# EAGLE schematic LiPoLoader_td (EAGLE 5.09)
BEST: Farnell 1611967; TYP: EEUFM1V102
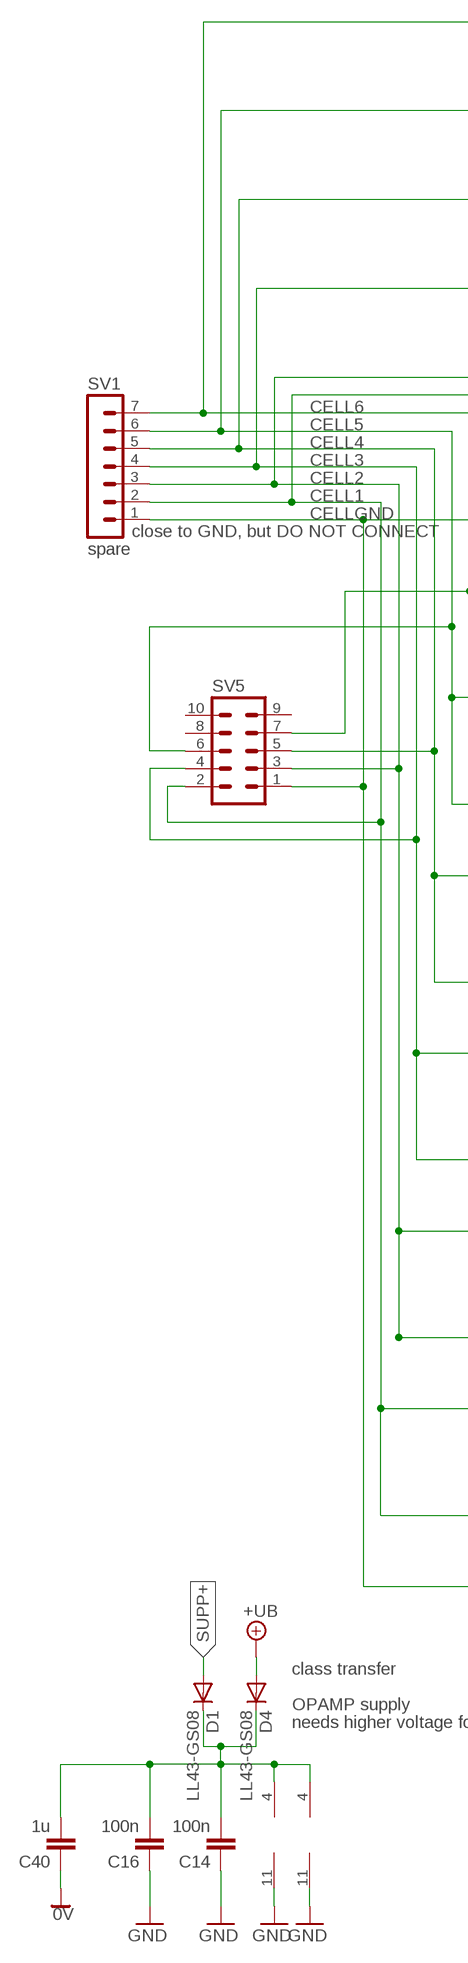
[diagram p0: schematic, sheet 1, part 1 of 2]
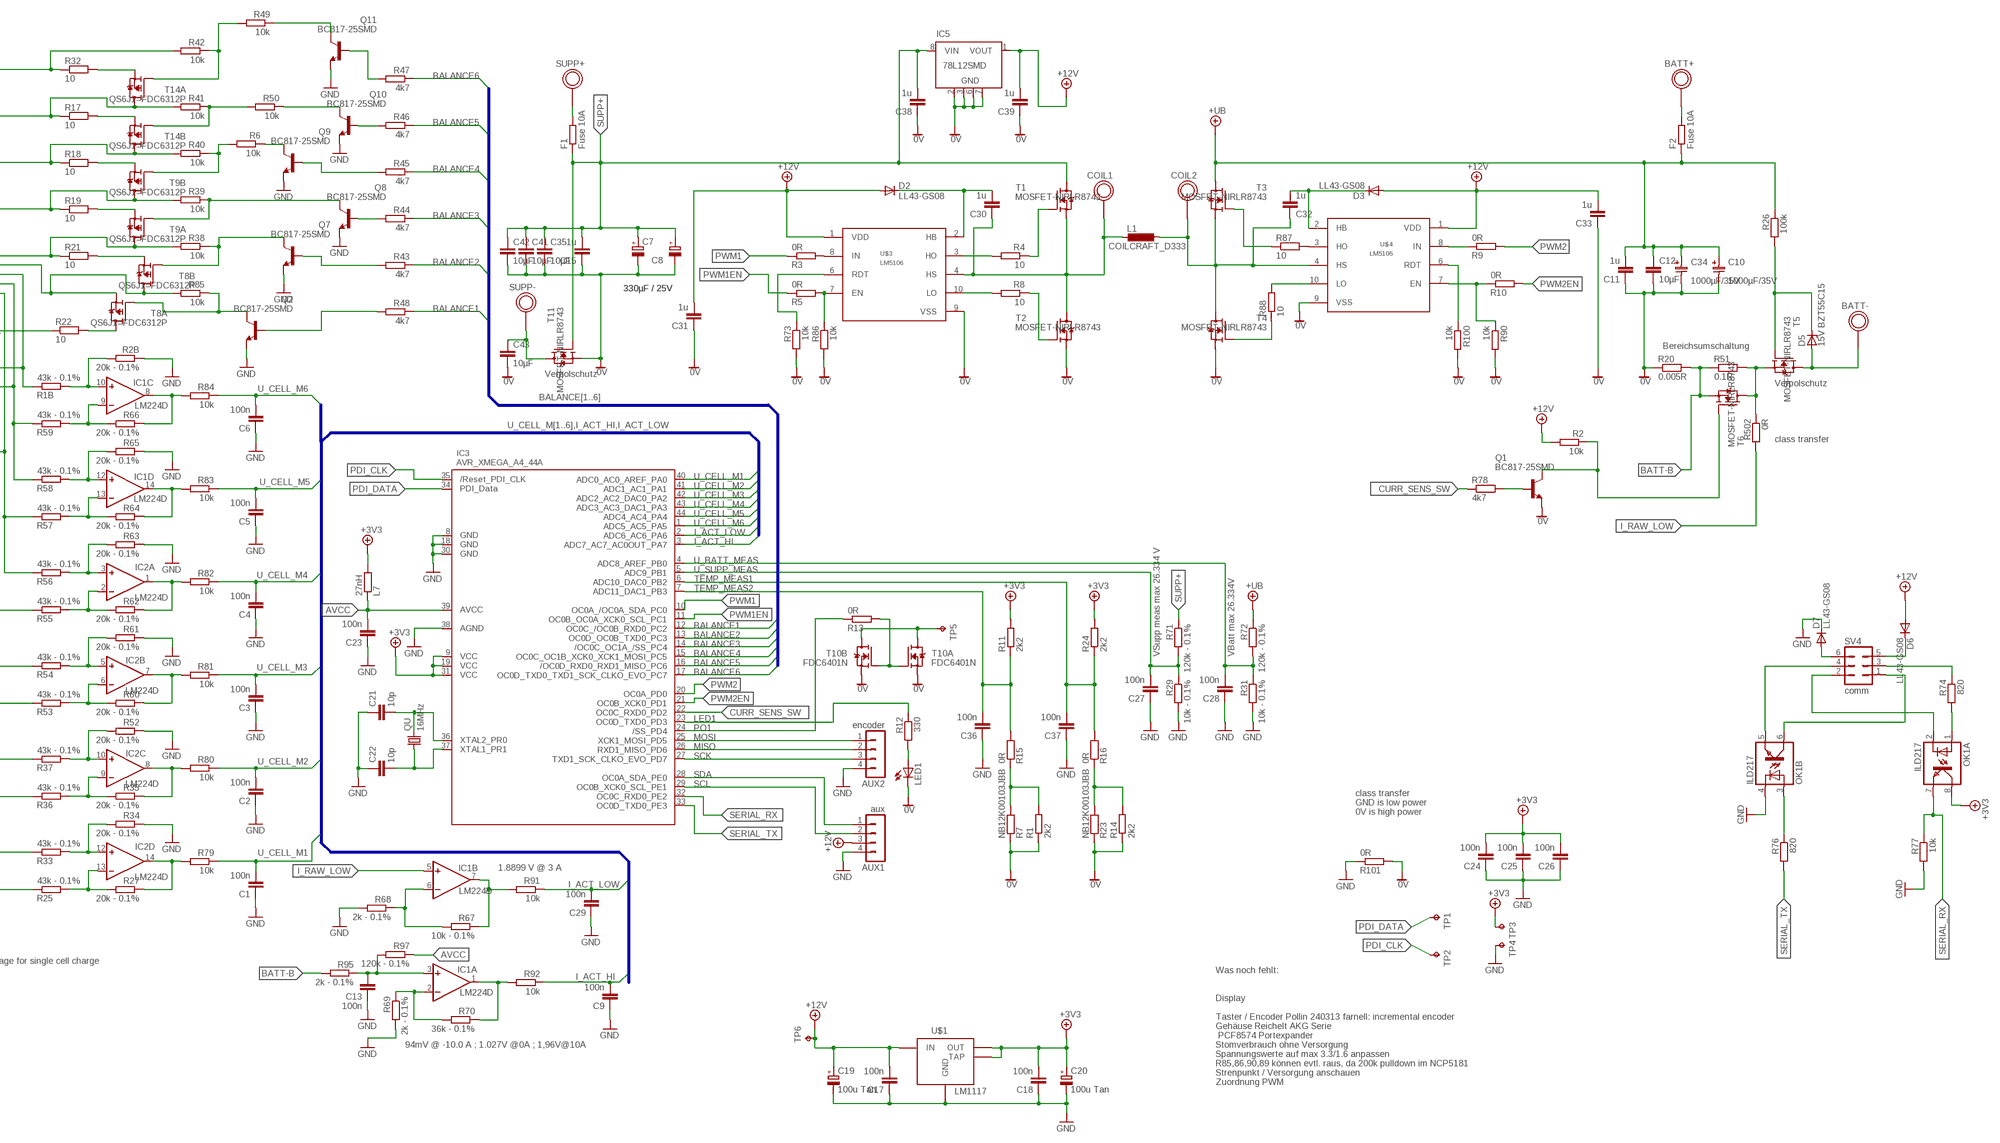
[diagram p1: schematic, sheet 1, part 2 of 2]

## Parts
AUX1  aux  MA04-1  [MA04-1]
AUX2  encoder  MA04-1  [MA04-1]
BATT+  SOLPAD3MM  [SOLPAD3MM]
BATT-  SOLPAD3MM  [SOLPAD3MM]
C1  100n  C-EUC0603K  [C0603K]
C2  100n  C-EUC0603K  [C0603K]
C3  100n  C-EUC0603K  [C0603K]
C4  100n  C-EUC0603K  [C0603K]
C5  100n  C-EUC0603K  [C0603K]
C6  100n  C-EUC0603K  [C0603K]
C7  330µF / 25V  CPOL-EUE3.5-8  [E3,5-8]
C8  330µF / 25V  CPOL-EUE3.5-8  [E3,5-8]
C9  100n  C-EUC0603K  [C0603K]
C10  1000µF/35V  CPOL  [E5-13-L]
C11  1u  C-EUC1206K  [C1206K]
C12  10µF  C-EUC1206K  [C1206K]
C13  100n  C-EUC0603K  [C0603K]
C14  100n  C-EUC0603K  [C0603K]
C15  1u  C-EUC1206K  [C1206K]
C16  100n  C-EUC0603K  [C0603K]
C17  100n  C-EUC0603K  [C0603K]
C18  100n  C-EUC0603K  [C0603K]
C19  100u Tan  CPOL-EUSMCC  [SMC_C]
C20  100u Tan  CPOL-EUSMCC  [SMC_C]
C21  10p  C-EUC0603  [C0603]
C22  10p  C-EUC0603  [C0603]
C23  100n  C-EUC0603K  [C0603K]
C24  100n  C-EUC0603K  [C0603K]
C25  100n  C-EUC0603K  [C0603K]
C26  100n  C-EUC0603K  [C0603K]
C27  100n  C-EUC0603K  [C0603K]
C28  100n  C-EUC0603K  [C0603K]
C29  100n  C-EUC0603K  [C0603K]
C30  1u  C-EUC1206K  [C1206K]
C31  1u  C-EUC1206K  [C1206K]
C32  1u  C-EUC1206K  [C1206K]
C33  1u  C-EUC1206K  [C1206K]
C34  1000µF/35V  CPOL  [E5-13-L]
C35  10µF  C-EUC1206K  [C1206K]
C36  100n  C-EUC0603K  [C0603K]
C37  100n  C-EUC0603K  [C0603K]
C38  1u  C-EUC1206K  [C1206K]
C39  1u  C-EUC1206K  [C1206K]
C40  1u  C-EUC1206K  [C1206K]
C41  10µF  C-EUC1206K  [C1206K]
C42  10µF  C-EUC1206K  [C1206K]
C43  10µF  C-EUC1206K  [C1206K]
COIL1  SOLPAD3MM  [SOLPAD3MM]
COIL2  SOLPAD3MM  [SOLPAD3MM]
D1  LL43-GS08  DIODE-SOD80C  [SOD80C]
D2  LL43-GS08  DIODE-SOD80C  [SOD80C]
D3  LL43-GS08  DIODE-SOD80C  [SOD80C]
D4  LL43-GS08  DIODE-SOD80C  [SOD80C]
D5  15V BZT55C15  ZENER-DIODESOD80C  [SOD80C]
D6  LL43-GS08  DIODE-SOD80C  [SOD80C]
D7  LL43-GS08  DIODE-SOD80C  [SOD80C]
F1  Fuse 10A  R-EU_WSC2515  [WSC2515]
F2  Fuse 10A  R-EU_WSC2515  [WSC2515]
IC1  LM224D  LM324D  [SO14]
IC2  LM224D  LM324D  [SO14]
IC3  AVR_XMEGA_A4_44A  [TQFP44]
IC5  78L12SMD  78L05SMD  [SO08]
L1  COILCRAFT_D333  [D333]
L7  27nH  R-EU_R0603  [R0603]
LED1  LED5MM  [LED5MM]
OK1  ILD217  [SOIC08]
Q1  BC817-25SMD  [SOT23-BEC]
Q2  BC817-25SMD  [SOT23-BEC]
Q7  BC817-25SMD  [SOT23-BEC]
Q8  BC817-25SMD  [SOT23-BEC]
Q9  BC817-25SMD  [SOT23-BEC]
Q10  BC817-25SMD  [SOT23-BEC]
Q11  BC817-25SMD  [SOT23-BEC]
QU  16MHz  CRYSTALHC49U-V  [HC49U-V]
R1  2k2  R-EU_R0603  [R0603]
R1B  43k - 0.1%  R-EU_R0603  [R0603]
R2  10k  R-EU_R0603  [R0603]
R2B  20k - 0.1%  R-EU_R0603  [R0603]
R3  0R  R-EU_R0603  [R0603]
R4  10  R-EU_R0603  [R0603]
R5  0R  R-EU_R0603  [R0603]
R6  10k  R-EU_R0603  [R0603]
R7  NB12K00103JBB  R-EU_R0603  [R0603]
R8  10  R-EU_R0603  [R0603]
R9  0R  R-EU_R0603  [R0603]
R10  0R  R-EU_R0603  [R0603]
R11  2k2  R-EU_R0603  [R0603]
R12  330  R-EU_R0805  [R0805]
R13  0R  R-EU_R0603  [R0603]
R14  2k2  R-EU_R0603  [R0603]
R15  0R  R-EU_R0603  [R0603]
R16  0R  R-EU_R0603  [R0603]
R17  10  R-EU_R2512  [R2512]
R18  10  R-EU_R2512  [R2512]
R19  10  R-EU_R2512  [R2512]
R20  0.005R  R-EU_R2010  [R2010]
R21  10  R-EU_R2512  [R2512]
R22  10  R-EU_R2512  [R2512]
R23  NB12K00103JBB  R-EU_R0603  [R0603]
R24  2k2  R-EU_R0603  [R0603]
R25  43k - 0.1%  R-EU_R0603  [R0603]
R26  100k  R-EU_R0603  [R0603]
R27  20k - 0.1%  R-EU_R0603  [R0603]
R29  10k - 0.1%  R-EU_R0603  [R0603]
R31  10k - 0.1%  R-EU_R0603  [R0603]
R32  10  R-EU_R2512  [R2512]
R33  43k - 0.1%  R-EU_R0603  [R0603]
R34  20k - 0.1%  R-EU_R0603  [R0603]
R35  20k - 0.1%  R-EU_R0603  [R0603]
R36  43k - 0.1%  R-EU_R0603  [R0603]
R37  43k - 0.1%  R-EU_R0603  [R0603]
R38  10k  R-EU_R0603  [R0603]
R39  10k  R-EU_R0603  [R0603]
R40  10k  R-EU_R0603  [R0603]
R41  10k  R-EU_R0603  [R0603]
R42  10k  R-EU_R0603  [R0603]
R43  4k7  R-EU_R0603  [R0603]
R44  4k7  R-EU_R0603  [R0603]
R45  4k7  R-EU_R0603  [R0603]
R46  4k7  R-EU_R0603  [R0603]
R47  4k7  R-EU_R0603  [R0603]
R48  4k7  R-EU_R0603  [R0603]
R49  10k  R-EU_R0603  [R0603]
R50  10k  R-EU_R0603  [R0603]
R51  0.1R  R-EU_R2010  [R2010]
R52  20k - 0.1%  R-EU_R0603  [R0603]
R53  43k - 0.1%  R-EU_R0603  [R0603]
R54  43k - 0.1%  R-EU_R0603  [R0603]
R55  43k - 0.1%  R-EU_R0603  [R0603]
R56  43k - 0.1%  R-EU_R0603  [R0603]
R57  43k - 0.1%  R-EU_R0603  [R0603]
R58  43k - 0.1%  R-EU_R0603  [R0603]
R59  43k - 0.1%  R-EU_R0603  [R0603]
R60  20k - 0.1%  R-EU_R0603  [R0603]
R61  20k - 0.1%  R-EU_R0603  [R0603]
R62  20k - 0.1%  R-EU_R0603  [R0603]
R63  20k - 0.1%  R-EU_R0603  [R0603]
R64  20k - 0.1%  R-EU_R0603  [R0603]
R65  20k - 0.1%  R-EU_R0603  [R0603]
R66  20k - 0.1%  R-EU_R0603  [R0603]
R67  10k - 0.1%  R-EU_R0603  [R0603]
R68  2k - 0.1%  R-EU_R0603  [R0603]
R69  2k - 0.1%  R-EU_R0603  [R0603]
R70  36k - 0.1%  R-EU_R0603  [R0603]
R71  120k - 0.1%  R-EU_R0603  [R0603]
R72  120k - 0.1%  R-EU_R0603  [R0603]
R73  10k  R-EU_R0603  [R0603]
R74  820  R-EU_R0603  [R0603]
R76  820  R-EU_R0603  [R0603]
R77  10k  R-EU_R0603  [R0603]
R78  4k7  R-EU_R0603  [R0603]
R79  10k  R-EU_R0603  [R0603]
R80  10k  R-EU_R0603  [R0603]
R81  10k  R-EU_R0603  [R0603]
R82  10k  R-EU_R0603  [R0603]
R83  10k  R-EU_R0603  [R0603]
R84  10k  R-EU_R0603  [R0603]
R85  10k  R-EU_R0603  [R0603]
R86  10k  R-EU_R0603  [R0603]
R87  10  R-EU_R0603  [R0603]
R88  10  R-EU_R0603  [R0603]
R90  10k  R-EU_R0603  [R0603]
R91  10k  R-EU_R0603  [R0603]
R92  10k  R-EU_R0603  [R0603]
R95  2k - 0.1%  R-EU_R0603  [R0603]
R97  120k - 0.1%  R-EU_R0603  [R0603]
R100  10k  R-EU_R0603  [R0603]
R101  0R  R-EU_R0603  [R0603]
R502  0R  R-EU_R0603  [R0603]
SUPP+  SOLPAD3MM  [SOLPAD3MM]
SUPP-  SOLPAD3MM  [SOLPAD3MM]
SV1  spare  MA07-1  [MA07-1]
SV4  comm  ML6L  [ML6L]
SV5  CON_BOX_10L  [ML10L]
T1  MOSFET-NIRLR8743  [DPAK]
T2  MOSFET-NIRLR8743  [DPAK]
T3  MOSFET-NIRLR8743  [DPAK]
T4  MOSFET-NIRLR8743  [DPAK]
T5  MOSFET-NIRLR8743  [DPAK]
T6  MOSFET-NIRLR8743  [DPAK]
T8  QS6J1=FDC6312P  [SUPERSOT-6]
T9  QS6J1=FDC6312P  [SUPERSOT-6]
T10  FDC6401N  [SUPERSOT-6]
T11  MOSFET-NIRLR8743  [DPAK]
T14  QS6J1=FDC6312P  [SUPERSOT-6]
TP1  TPTP15R  [TP15R]
TP2  TPTP15R  [TP15R]
TP3  TPTP15R  [TP15R]
TP4  TPTP15R  [TP15R]
TP5  TPTP15R  [TP15R]
TP6  TPTP15R  [TP15R]
U$1  LM1117  [SOT223]
U$3  LM5106  [MSOP10W]
U$4  LM5106  [MSOP10W]

## Nets
0V [Hi-Power]: C7.- C8.- C10.- C11.1 C12.2 C15.1 C31.1 C33.1 C34.- C35.2 C38.1 C39.1 C40.1 C41.2 C42.2 C43.2 IC5.2(GND) IC5.3(GND) IC5.6(GND) IC5.7(GND) LED1.K(C) Q1.E R1.1 R7.1 R14.1 R20.1 R23.1 R73.2 R86.2 R90.2 R100.2 R101.2 T2.3(S) T4.3(S) T10.P$2(B:S) T10.P$5(A:S) T11.3(S) U$3.9(VSS) U$4.9(VSS)
+3V3 [Lo-Power]: C18.2 C20.+ C24.2 C25.2 C26.2 IC3.9(VCC1) IC3.19(VCC2) IC3.31(VCC3) L7.2 OK1.8(A:COL) R11.2 R24.2 TP3.TP U$1.MID(OUT) U$1.TAP
+12V [Lo-Power]: AUX1.3 C17.2 C19.+ C31.2 C33.2 C39.2 D2.A D3.A D6.A IC5.1(VOUT) R2.2 TP6.TP U$1.RIGHT(IN) U$3.1(VDD) U$4.1(VDD)
+UB [Hi-Power]: C10.+ C11.2 C12.1 C34.+ D4.A F2.1 R26.1 R72.1 T3.4(D)
AVCC: C23.2 IC3.39(AVCC) L7.1 R97.1
BALANCE1: IC3.12(PC2) R48.1
BALANCE2: IC3.13(PC3) R43.1
BALANCE3: IC3.14(PC4) R44.1
BALANCE4: IC3.15(PC5) R45.1
BALANCE5: IC3.16(PC6) R46.1
BALANCE6: IC3.17(PC7) R47.1
BATT- [Hi-Power]: BATT-.P$1 D5.A T5.4(D)
BATT-A [Hi-Power]: R51.2 R502.1 T5.3(S) T6.4(D)
BATT-B [Hi-Power]: R20.2 R51.1 R95.2 T6.3(S)
BUS_GND [Iso-bus]: OK1.2(A:C) SV4.2
BUS_RX [Iso-bus]: R74.1 SV4.3
BUS_SUPP [Iso-bus]: OK1.6(B:COL) SV4.1
BUS_TX [Iso-bus]: OK1.5(B:EMIT) SV4.4
CELL1 [Lo-Power]: R33.1 R36.1 R85.2 SV1.2 SV5.2 T8.P$4(B:D) T8.P$5(A:S)
CELL2 [Lo-Power]: R21.1 R37.1 R38.2 R53.1 SV1.3 SV5.3 T9.P$6(A:D)
CELL3 [Lo-Power]: R19.1 R39.2 R54.1 R55.1 SV1.4 SV5.4 T9.P$4(B:D)
CELL4 [Lo-Power]: R18.1 R40.2 R56.1 R57.1 SV1.5 SV5.5 T14.P$4(B:D)
CELL5 [Lo-Power]: R17.1 R41.2 R58.1 R59.1 SV1.6 SV5.6 T14.P$6(A:D)
CELL6 [Lo-Power]: R1B.1 R32.1 R42.2 SV1.7 SV5.7
CELLGND [Lo-Power]: R22.1 R25.1 SV1.1 SV5.1
CURR_SENS_SW: IC3.22(PD2) R78.1
GND [Lo-Power]: AUX1.4 AUX2.4 C1.1 C2.1 C3.1 C4.1 C5.1 C6.1 C9.1 C13.1 C14.1 C16.1 C17.1 C18.1 C19.- C20.- C21.1 C22.1 C23.1 C24.1 C25.1 C26.1 C27.1 C28.1 C29.1 C36.1 C37.1 D7.C IC1.11(P:V-) IC2.11(P:V-) IC3.8(GND1) IC3.18(GND2) IC3.30(GND3) IC3.38(AGND) OK1.4(B:C) Q2.E Q7.E Q8.E Q9.E Q10.E Q11.E R2B.1 R29.2 R31.2 R34.1 R52.1 R61.1 R63.1 R65.1 R68.2 R69.2 R77.2 R101.1 TP4.TP U$1.LEFT(GND)
I_ACT_HI: C9.2 IC3.3(PA7) R92.1
I_ACT_LOW: C29.2 IC3.2(PA6) R91.1
I_RAW_HI_R: C13.2 IC1.3(A:+IN) R95.1 R97.2
I_RAW_LOW: IC1.5(B:+IN) R502.2
LED1: IC3.23(PD3) R12.1
MISO: AUX2.2 IC3.26(PD6)
MOSI: AUX2.1 IC3.25(PD5)
N$1: IC1.10(C:+IN) R1B.2 R2B.2
N$2: IC1.12(D:+IN) R58.2 R65.2
N$3: IC1.9(C:-IN) R59.2 R66.2
N$4 [Lo-Power]: R8.1 T2.1(G)
N$5 [Lo-Power]: R87.2 U$4.3(HO)
N$6 [Lo-Power]: R22.2 T8.P$6(A:D)
N$7: IC1.13(D:-IN) R57.2 R64.2
N$8: IC1.6(B:-IN) R67.2 R68.1
N$9: R100.1 U$4.6(RDT)
N$10: OK1.3(B:A) R76.1
N$11: IC2.3(A:+IN) R56.2 R63.2
N$12: IC2.2(A:-IN) R55.2 R62.2
N$13 [Lo-Power]: R88.1 T4.1(G)
N$14 [Hi-Power]: BATT+.P$1 F2.2
N$15 [Lo-Power]: R4.2 U$3.3(HO)
N$16: IC2.5(B:+IN) R54.2 R61.2
N$17: IC2.6(B:-IN) R53.2 R60.2
N$18: IC2.12(D:+IN) R33.2 R34.2
N$19 [Lo-Power]: D7.A SV4.6
N$20: LED1.A R12.2
N$21: IC2.10(C:+IN) R37.2 R52.2
N$22: IC2.9(C:-IN) R35.2 R36.2
N$23: IC2.13(D:-IN) R25.2 R27.2
N$24 [Iso-bus]: OK1.1(A:A) R74.2
N$25 [Hi-Power]: C32.1 COIL2.P$1 L1.2 T3.3(S) T4.4(D) U$4.4(HS)
N$28: IC1.2(A:-IN) R69.1 R70.2
N$30: IC1.8(C:OUT) R66.1 R84.2
N$31: C21.2 IC3.36(PR0) QU.2
N$32: C22.2 IC3.37(PR1) QU.1
N$33 [Lo-Power]: T10.P$4(B:D) T10.P$6(A:D) TP5.TP
N$35: Q1.B R78.2
N$36: IC1.7(B:OUT) R67.1 R91.2
N$37 [Hi-Power]: C30.1 COIL1.P$1 L1.1 T1.3(S) T2.4(D) U$3.4(HS)
N$39 [Hi-Power]: F1.2 SUPP+.P$1
N$40: D5.C R26.2 T5.1(G)
N$41: Q8.C R39.1 T9.P$1(A:G)
N$42: Q9.C R6.1
N$43: R5.2 R86.1 U$3.7(EN)
N$44: R9.1 U$4.8(IN)
N$46: R13.2 T10.P$1(A:G) T10.P$3(B:G)
N$48 [Lo-Power]: R21.2 T8.P$2(B:S)
N$49 [Lo-Power]: R19.2 T9.P$5(A:S)
N$50: IC1.14(D:OUT) R64.1 R83.2
N$51 [Lo-Power]: R18.2 T9.P$2(B:S)
N$52 [Lo-Power]: R17.2 T14.P$2(B:S)
N$53 [Lo-Power]: R32.2 T14.P$5(A:S)
N$54: Q2.C R85.1 T8.P$1(A:G)
N$55: Q7.B R43.2
N$56: Q8.B R44.2
N$57: Q9.B R45.2
N$58: Q10.B R46.2
N$59: Q11.B R47.2
N$60: IC2.1(A:OUT) R62.1 R82.2
N$62: R6.2 R40.1 T9.P$3(B:G)
N$63: R41.1 R50.2 T14.P$3(B:G)
N$64: R42.1 R49.2 T14.P$1(A:G)
N$65: Q7.C R38.1 T8.P$3(B:G)
N$66: IC2.7(B:OUT) R60.1 R81.2
N$67: Q11.C R49.1
N$68: Q10.C R50.1
N$69: IC2.8(C:OUT) R35.1 R80.2
N$70: IC2.14(D:OUT) R27.1 R79.2
N$71: R1.2 R7.2 R15.1
N$72 [Lo-Power]: R8.2 U$3.10(LO)
N$73 [Lo-Power]: R4.1 T1.1(G)
N$74: R3.2 U$3.8(IN)
N$75: R14.2 R16.1 R23.2
N$76: R73.1 U$3.6(RDT)
N$77 [Lo-Power]: C30.2 D2.C U$3.2(HB)
N$78: IC1.1(A:OUT) R70.1 R92.2
N$79 [Lo-Power]: R88.2 U$4.10(LO)
N$80 [Lo-Power]: R87.1 T3.1(G)
N$81: R10.1 R90.1 U$4.7(EN)
N$82: Q1.C R2.1 T6.1(G)
N$83 [Lo-Power]: C32.2 D3.C U$4.2(HB)
N$84 [Lo-Power]: D6.C SV4.5
N$85: Q2.B R48.2
OPAMP_SUPP [Lo-Power]: C14.2 C16.2 C40.2 D1.C D4.C IC1.4(P:V+) IC2.4(P:V+)
PDI_CLK: IC3.35(RESET) TP2.TP
PDI_DATA: IC3.34(PDI_DATA) TP1.TP
PO1: IC3.24(PD4) R13.1
PWM1: IC3.10(PC0) R3.1
PWM1EN: IC3.11(PC1) R5.1
PWM2: IC3.20(PD0) R9.2
PWM2EN: IC3.21(PD1) R10.2
SCK: AUX2.3 IC3.27(PD7)
SCL: AUX1.2 IC3.29(PE1)
SDA: AUX1.1 IC3.28(PE0)
SERIAL_RX: IC3.32(PE2) OK1.7(A:EMIT) R77.1
SERIAL_TX: IC3.33(PE3) R76.2
SUPP+ [Hi-Power]: C7.+ C8.+ C15.2 C35.1 C38.2 C41.1 C42.1 D1.A F1.1 IC5.8(VIN) R71.1 T1.4(D) T11.1(G)
SUPP-A [Hi-Power]: C43.1 SUPP-.P$1 T11.4(D)
TEMP_MEAS1: C37.2 IC3.6(PB2) R16.2 R24.1
TEMP_MEAS2: C36.2 IC3.7(PB3) R11.1 R15.2
U_BATT_MEAS: C28.2 IC3.4(PB0) R31.1 R72.2
U_CELL_M1: C1.2 IC3.40(PA0) R79.1
U_CELL_M2: C2.2 IC3.41(PA1) R80.1
U_CELL_M3: C3.2 IC3.42(PA2) R81.1
U_CELL_M4: C4.2 IC3.43(PA3) R82.1
U_CELL_M5: C5.2 IC3.44(PA4) R83.1
U_CELL_M6: C6.2 IC3.1(PA5) R84.1
U_SUPP_MEAS: C27.2 IC3.5(PB1) R29.1 R71.2
Unconnected: IC5.4(NC) IC5.5(NC) SV5.8 SV5.9 SV5.10

## Buses
U_CELL_M[1..6],I_ACT_HI,I_ACT_LOW
BALANCE[1..6]

## Notes on the sheet
- close to GND, but DO NOT CONNECT
- Bereichsumschaltung
- Verpolschutz
- Verpolschutz
- class transfer
- VSupp meas max 26.334 V | VBatt max 26.334V
- class transfer
- GND is low power
- 0V is high power
- 1.8899 V @ 3 A
- class transfer
- OPAMP supply
- needs higher voltage for single cell charge
- Was noch fehlt:
- Display
- Taster / Encoder Pollin 240313 farnell: incremental encoder
- Gehäuse Reichelt AKG Serie
- PCF8574 Portexpander
- 94mV @ -10.0 A ; 1.027V @0A ; 1,96V@10A | Stomverbrauch ohne Versorgung
- Spannungswerte auf max 3.3/1.6 anpassen
- R85,86,90,89 können evtl. raus, da 200k pulldown im NCP5181
- Strenpunkt / Versorgung anschauen
- Zuordnung PWM

## Library data of the parts
AUX1 AUX2 = Fabian:MA04-1: PIN HEADER
BATT+ BATT- COIL1 COIL2 SUPP+ SUPP- = Fabian:SOLPAD3MM: 3mm solder pad
C1-C6 C9 C11-C18 C21-C33 C35-C43 = rcl:C-EU: CAPACITOR, European symbol
C7 C8 C19 C20 = rcl:CPOL-EU: POLARIZED CAPACITOR, European symbol
C10 C34 = Fabian:CPOL: Elko 12.5mm dia, length 30mm
D1-D4 D6 D7 = diode:DIODE-: DIODE
D5 = diode:ZENER-DIODE: Z-Diode
F1 F2 L7 R1 R1B R2 R2B R3-R27 R29 R31-R74 R76-R88 R90-R92 R95 R97 R100 R101 R502 = rcl:R-EU_: RESISTOR, European symbol
IC1 IC2 = linear:LM324: OP AMP
IC3 = xmega:AVR_XMEGA_A4_: Device for Atmel AVR XMEGA A4 Series
IC5 = linear:78L*SMD: Positive VOLTAGE REGULATOR
L1 = Fabian:COILCRAFT_D333: COILCRAFT
LED1 = led:LED: LED OSRAM: - CHIPLED LG R971, LG N971, LY N971, LG Q971, LY Q971, LO R971, LY R971 LH N974, LH R974 LS Q976, LO Q976, LY Q976 LO Q996 - Hyper CHIPLED LW Q18S LB Q993, LB Q99A, LB R99A - SideLED LS A670, LO A670, LY A670, LG A670, LP A670 LB A673, LV A673, LT A673, LW A673 LH A674 LY A675 LS A676, LA A676, LO A676, LY A676, LW A676 LS A679, LY A679, LG A679 - Hyper Micro SIDELED® LS Y876, LA Y876, LO Y876, LY Y876 LT Y87S - SmartLED LW L88C, LW L88S LB L89C, LB L89S, LG L890 LS L89K, LO L89K, LY L89K LS L896, LA L896, LO L896, LY L896 - TOPLED LS T670, LO T670, LY T670, LG T670, LP T670 LSG T670, LSP T670, LSY T670, LOP T670, LYG T670 LG T671, LOG T671, LSG T671 LB T673, LV T673, LT T673, LW T673 LH T674 LS T676, LA T676, LO T676, LY T676, LB T676, LH T676, LSB T676, LW T676 LB T67C, LV T67C, LT T67C, LS T67K, LO T67K, LY T67K, LW E67C LS E67B, LA E67B, LO E67B, LY E67B, LB E67C, LV E67C, LT E67C LW T67C LS T679, LY T679, LG T679 LS T770, LO T770, LY T770, LG T770, LP T770 LB T773, LV T773, LT T773, LW T773 LH T774 LS E675, LA E675, LY E675, LS T675 LS T776, LA T776, LO T776, LY T776, LB T776 LHGB T686 LT T68C, LB T68C - Hyper Mini TOPLED® LB M676 - Mini TOPLED Santana® LG M470 LS M47K, LO M47K, LY M47K Source: http://www.osram.convergy.de LUXEON: - LUMILED® LXK2-PW12-R00, LXK2-PW12-S00, LXK2-PW14-U00, LXK2-PW14-V00 LXK2-PM12-R00, LXK2-PM12-S00, LXK2-PM14-U00 LXK2-PE12-Q00, LXK2-PE12-R00, LXK2-PE12-S00, LXK2-PE14-T00, LXK2-PE14-U00 LXK2-PB12-K00, LXK2-PB12-L00, LXK2-PB12-M00, LXK2-PB14-N00, LXK2-PB14-P00, LXK2-PB14-Q00 LXK2-PR12-L00, LXK2-PR12-M00, LXK2-PR14-Q00, LXK2-PR14-R00 LXK2-PD12-Q00, LXK2-PD12-R00, LXK2-PD12-S00 LXK2-PH12-R00, LXK2-PH12-S00 LXK2-PL12-P00, LXK2-PL12-Q00, LXK2-PL12-R00 Source: www.luxeon.com KINGBRIGHT: KA-3528ASYC Source: www.kingbright.com
OK1 = optocoupler:ILD2*: Siemens ILD205/206/207/211/213/217 DUAL PHOTOTRANSISTOR SMALL OUTLINE SURFACE MOUNT OPTOCOUPLER Source: 153385-da-01-en-Optocoupler_ILD205-T.pdf
Q1 Q2 Q7-Q11 = transistor-npn:BC817*: NPN Transistor
QU = crystal:CRYSTAL: CRYSTAL
SV1 = con-lstb:MA07-1: PIN HEADER
SV4 = con-harting-ml:ML6: HARTING
SV5 = Fabian:CON_BOX_10: tyco/multicomp; BEST: Farnell 1099245 od 835993
T1-T6 T11 = Fabian:MOSFET-N: N-channel Mosfet 30V HEXFET Power MOSFET IRLU8721PbF VDSS 30V RDS(on) max 8.4m Qg 8.5nC IRLR8726PbF VDSS 30V RDS(on) max5.8m Qg 15nC IRLR8743PbF VDSS 30V RDS(on) max3.1m Qg 39nC; BEST: Farnell 1551908
T8 T9 T14 = Fabian:QS6J1=FDC6312P: FDC6312P Dual P-Channel; BEST: Farnell 1525470 od 1700713
T10 = Fabian:FDC6401N: dual n mosfet; BEST: Farnell 1467966
TP1-TP6 = testpad:TP: Test pad
U$1 = Fabian:LM1117: lm1117 from National semi, buy from onlinecomponents.com add at least 10 uF at output Order No: LM1117MP-3.3
U$3 U$4 = Fabian:LM5106: LM5106 Drives both a high side and low side N-channel MOSFET ? 1.8A peak output sink current ? 1.2A peak output source current ? Bootstrap supply voltage range up to 118V DC ? Single TTL compatible Input ? Programmable turn-on delays (Dead-time) ? Enable Input pin ? Fast turn-off propagation delays (32ns typical) ? Drives 1000pF with 15ns rise and 10ns fall time ? Supply rail under-voltage lockout ? Low power consumption; BEST: Farnell 1312793

## Net classes
1 Hi-Power: width 0.3 mm
2 Lo-Power: width 0.3 mm
3 Iso-bus: clearance 0.6 mm to class 0, clearance 0.6 mm to class 1, clearance 0.6 mm to class 2